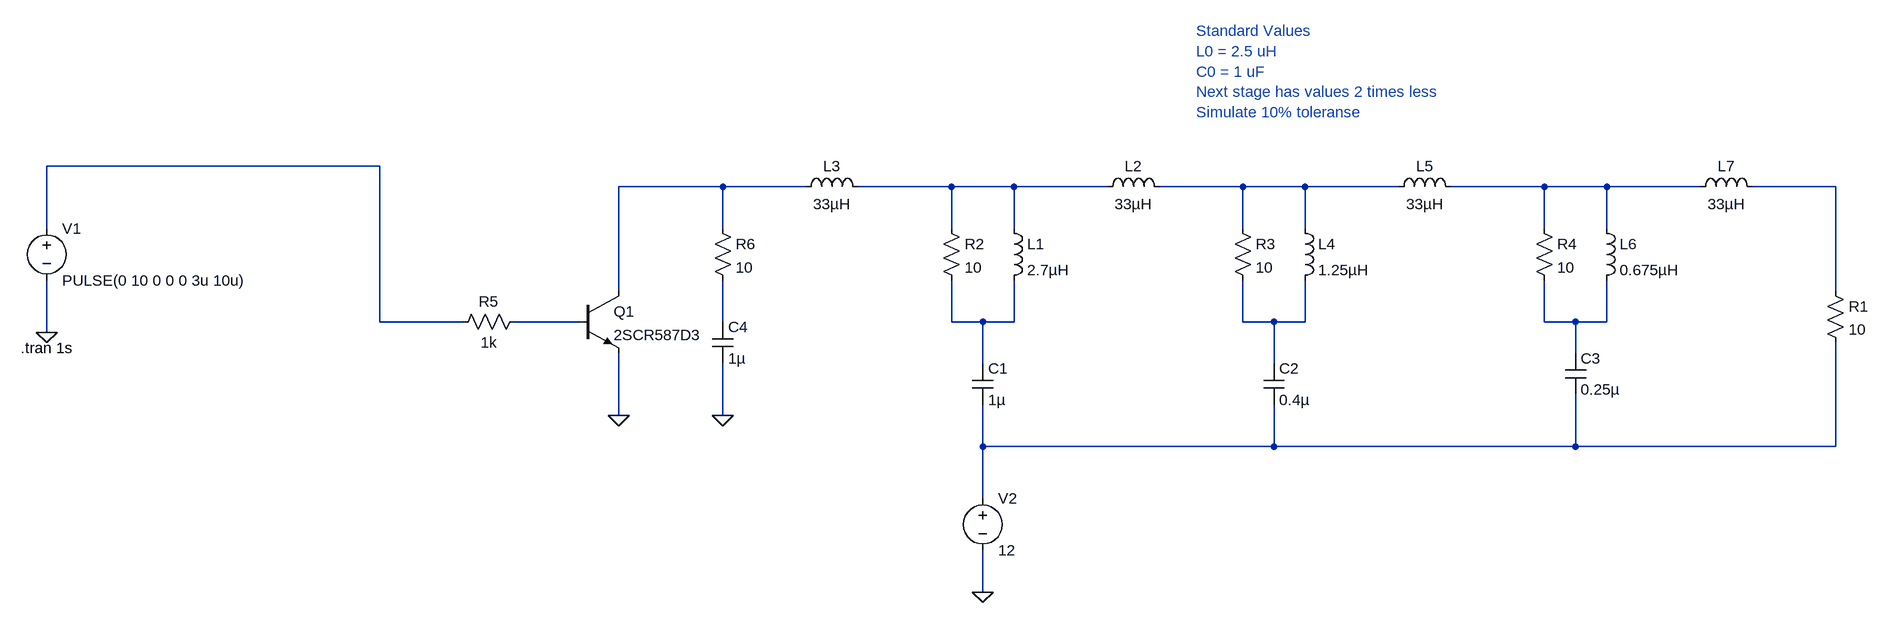
[diagram p0: schematic PWM_concept_02.asc]
PWM_concept_02.asc, the LTspice schematic file:
Version 4
SHEET 1 3368 680
WIRE -736 0 -1248 0
WIRE -208 32 -368 32
WIRE -80 32 -208 32
WIRE 144 32 0 32
WIRE 240 32 144 32
WIRE 384 32 240 32
WIRE 592 32 464 32
WIRE 688 32 592 32
WIRE 832 32 688 32
WIRE 1056 32 912 32
WIRE 1152 32 1056 32
WIRE 1296 32 1152 32
WIRE 1504 32 1376 32
WIRE -1248 96 -1248 0
WIRE -208 96 -208 32
WIRE 144 96 144 32
WIRE 240 96 240 32
WIRE 592 96 592 32
WIRE 688 96 688 32
WIRE 1056 96 1056 32
WIRE 1152 96 1152 32
WIRE -368 192 -368 32
WIRE 1504 192 1504 32
WIRE -736 240 -736 0
WIRE -608 240 -736 240
WIRE -432 240 -528 240
WIRE -208 240 -208 176
WIRE 144 240 144 176
WIRE 192 240 144 240
WIRE 240 240 240 176
WIRE 240 240 192 240
WIRE 592 240 592 176
WIRE 640 240 592 240
WIRE 688 240 688 176
WIRE 688 240 640 240
WIRE 1056 240 1056 176
WIRE 1104 240 1056 240
WIRE 1152 240 1152 176
WIRE 1152 240 1104 240
WIRE -1248 256 -1248 176
WIRE 1104 288 1104 240
WIRE 192 304 192 240
WIRE 640 304 640 240
WIRE -368 384 -368 288
WIRE -208 384 -208 304
WIRE 192 432 192 368
WIRE 640 432 640 368
WIRE 640 432 192 432
WIRE 1104 432 1104 352
WIRE 1104 432 640 432
WIRE 1504 432 1504 272
WIRE 1504 432 1104 432
WIRE 192 512 192 432
WIRE 192 656 192 592
FLAG -1248 256 0
FLAG -368 384 0
FLAG -208 384 0
FLAG 192 656 0
SYMBOL voltage -1248 80 R0
WINDOW 123 0 0 Left 0
WINDOW 39 0 0 Left 0
SYMATTR InstName V1
SYMATTR Value PULSE(0 10 0 0 0 3u 10u)
SYMBOL res 1488 176 R0
SYMATTR InstName R1
SYMATTR Value 10
SYMBOL cap 176 304 R0
SYMATTR InstName C1
SYMATTR Value 1µ
SYMBOL ind 224 80 R0
SYMATTR InstName L1
SYMATTR Value 2.7µH
SYMBOL ind 368 48 R270
WINDOW 0 32 56 VTop 2
WINDOW 3 5 56 VBottom 2
SYMATTR InstName L2
SYMATTR Value 33µH
SYMBOL ind -96 48 R270
WINDOW 0 32 56 VTop 2
WINDOW 3 5 56 VBottom 2
SYMATTR InstName L3
SYMATTR Value 33µH
SYMBOL cap 624 304 R0
SYMATTR InstName C2
SYMATTR Value 0.4µ
SYMBOL ind 672 80 R0
SYMATTR InstName L4
SYMATTR Value 1.25µH
SYMBOL ind 816 48 R270
WINDOW 0 32 56 VTop 2
WINDOW 3 5 56 VBottom 2
SYMATTR InstName L5
SYMATTR Value 33µH
SYMBOL cap 1088 288 R0
SYMATTR InstName C3
SYMATTR Value 0.25µ
SYMBOL ind 1136 80 R0
SYMATTR InstName L6
SYMATTR Value 0.675µH
SYMBOL ind 1280 48 R270
WINDOW 0 32 56 VTop 2
WINDOW 3 5 56 VBottom 2
SYMATTR InstName L7
SYMATTR Value 33µH
SYMBOL res 128 80 R0
SYMATTR InstName R2
SYMATTR Value 10
SYMBOL res 576 80 R0
SYMATTR InstName R3
SYMATTR Value 10
SYMBOL res 1040 80 R0
SYMATTR InstName R4
SYMATTR Value 10
SYMBOL npn -432 192 R0
SYMATTR InstName Q1
SYMATTR Value 2SCR587D3
SYMBOL res -512 224 R90
WINDOW 0 0 56 VBottom 2
WINDOW 3 32 56 VTop 2
SYMATTR InstName R5
SYMATTR Value 1k
SYMBOL res -224 80 R0
SYMATTR InstName R6
SYMATTR Value 10
SYMBOL cap -224 240 R0
SYMATTR InstName C4
SYMATTR Value 1µ
SYMBOL voltage 192 496 R0
WINDOW 123 0 0 Left 0
WINDOW 39 0 0 Left 0
SYMATTR InstName V2
SYMATTR Value 12
TEXT -1288 280 Left 2 !.tran 1s
TEXT 520 -208 Left 2 ;Standard Values\nL0 = 2.5 uH\nC0 = 1 uF\nNext stage has values 2 times less\nSimulate 10% toleranse

The netlist it stands for:
* PWM_concept_02.asc
V1 N001 0 PULSE(0 10 0 0 0 3u 10u)
R1 N006 N012 10
C1 N009 N012 1µ
L1 N003 N009 2.7µH
L2 N003 N004 33µH
L3 N002 N003 33µH
C2 N010 N012 0.4µ
L4 N004 N010 1.25µH
L5 N004 N005 33µH
C3 N011 N012 0.25µ
L6 N005 N011 0.675µH
L7 N005 N006 33µH
R2 N003 N009 10
R3 N004 N010 10
R4 N005 N011 10
Q1 N002 N007 0 0 2SCR587D3
R5 N007 N001 1k
R6 N002 N008 10
C4 N008 0 1µ
V2 N012 0 12
.model NPN NPN
.model PNP PNP
.lib standard.bjt
.tran 1s
* Standard Values
* L0 = 2.5 uH
* C0 = 1 uF
* Next stage has values 2 times less
* Simulate 10% toleranse
.backanno
.end